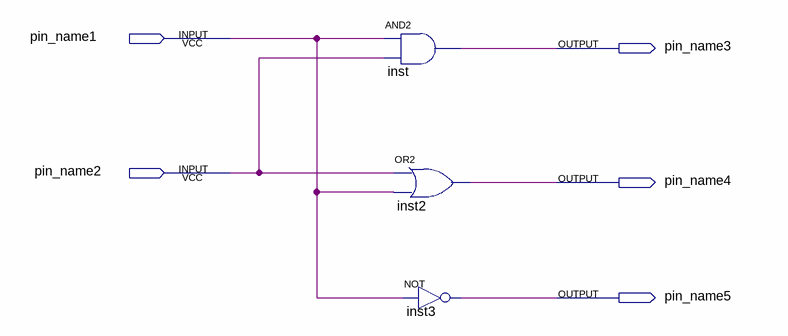
[diagram p0: schematic sheet]
// Quartus schematic Block1.bdf as structural Verilog: 3 symbols, 5 pins
module Block1 (
  input  pin_name1,
  input  pin_name2,
  output pin_name3,
  output pin_name4,
  output pin_name5
);

  and inst (pin_name3, pin_name1, pin_name2);
  or inst2 (pin_name4, pin_name2, pin_name1);
  not inst3 (pin_name5, pin_name1);
endmodule
